# Altium project ESP32遥控.PrjPCB
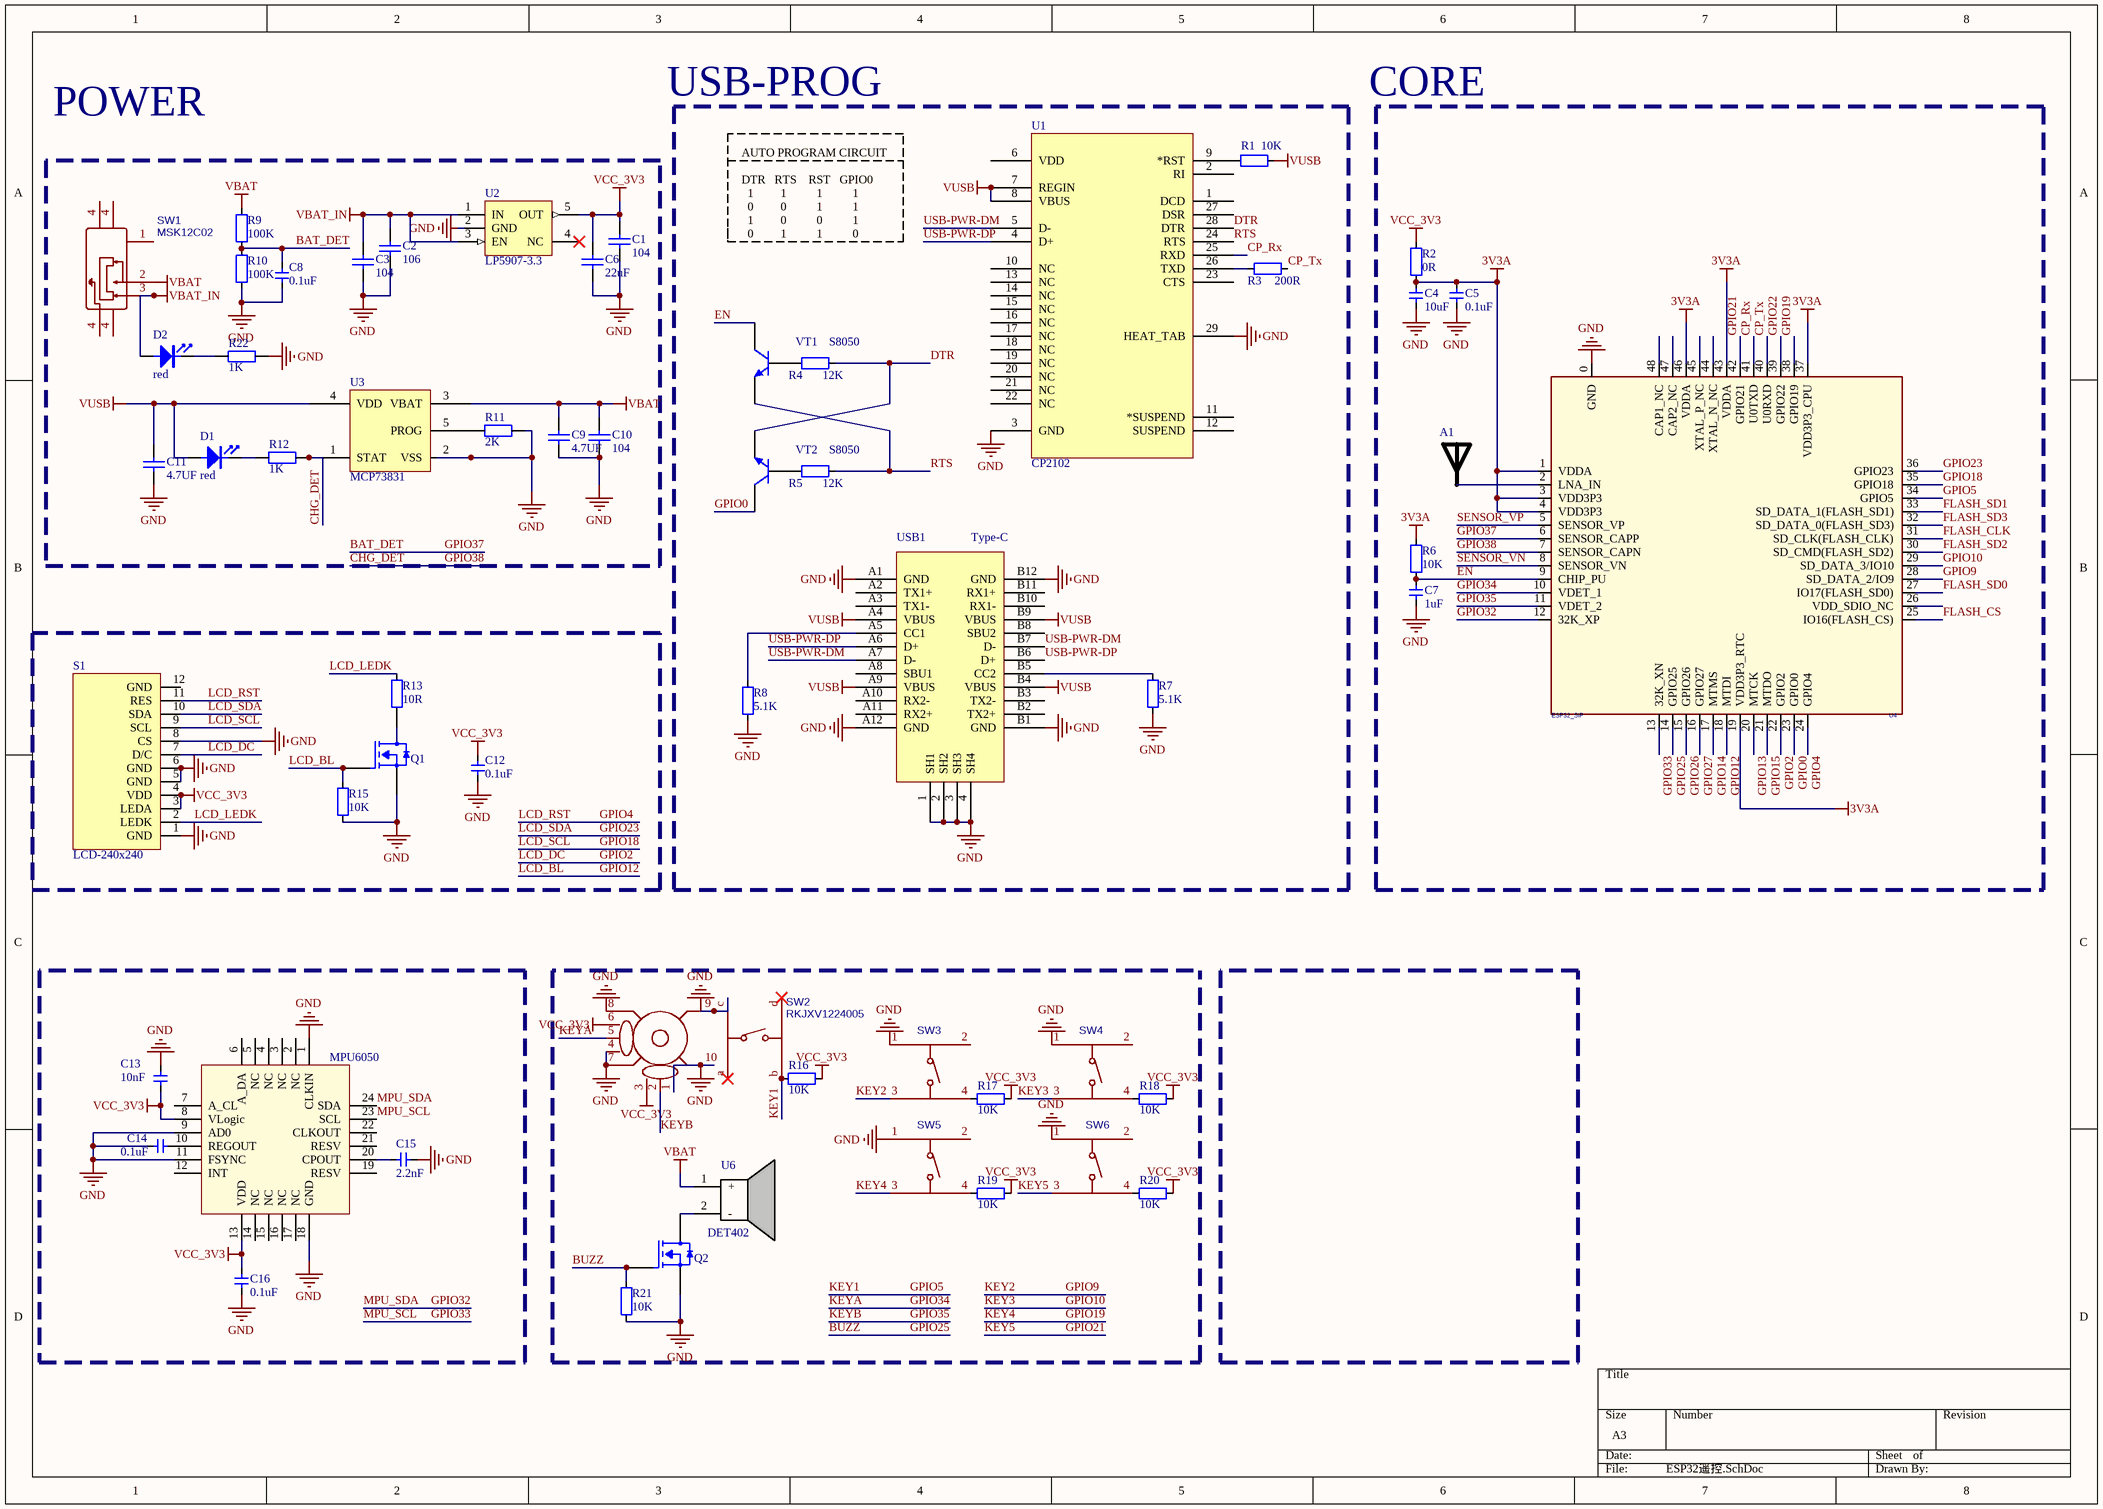
[diagram p0: ESP32遥控.SchDoc]
1 sheet, 58 parts. Net scope: global (net labels, ports and power ports of the same name join across sheets).
Board file: ESP32遥控.PcbDoc

## Sheet ESP32遥控.SchDoc
size A3

### Parts
A1  RAINSUN  [ANT-Rainsun-AN5120]  (value not drawn)
C1  104  [CAP_0402]
C2  106  [电容_C0603]
C3  104  [CAP_0402]
C4  10uF  [CAP_0402]
C5  0.1uF  [CAP_0402]
C6  22uF  [电容_C1206]
C7  1uF  [CAP_0402]
C8  0.1uF  [CAP_0402]
C9  4.7UF  [电容_C0805]
C10  104  [CAP_0402]
C11  4.7UF  [电容_C0805]
C12  0.1uF  [CAP_0402]
C13  10nF  [CAP_0402]
C14  0.1uF  [CAP_0402]
C15  2.2nF  [CAP_0402]
C16  0.1uF  [CAP_0402]
D1  red  [LED_0603]
D2  red  [LED_0603]
Q1  AO3400A  [SOT23-3]  (value not drawn)
Q2  AO3400A  [SOT23-3]  (value not drawn)
R1  10K  [RES_0402]
R2  0R  [RES_0402]
R3  200R  [RES_0402]
R4  12K  [RES_0402]
R5  12K  [RES_0402]
R6  10K  [RES_0402]
R7  5.1K  [RES_0402]
R8  5.1K  [RES_0402]
R9  100K  [RES_0402]
R10  100K  [RES_0402]
R11  2K  [RES_0402]
R12  1K  [RES_0402]
R13  10R  [RES_0402]
R15  10K  [RES_0402]
R16  10K  [RES_0402]
R17  10K  [RES_0402]
R18  10K  [RES_0402]
R19  10K  [RES_0402]
R20  10K  [RES_0402]
R21  10K  [RES_0402]
R22  1K  [RES_0402]
S1  LCD-240x240  [LCD-240x240-FlUSH-154]
SW1  MSK12C02  [SW-TH_MSK12C02]
SW2  RKJXV1224005  [SW-TH_RKJXV1224005]
SW3  (no value)  [KEY-SMD_4P-L6.0-W6.0-P4.50-LS8.6]
SW4  (no value)  [KEY-SMD_4P-L6.0-W6.0-P4.50-LS8.6]
SW5  (no value)  [KEY-SMD_4P-L6.0-W6.0-P4.50-LS8.6]
SW6  (no value)  [KEY-SMD_4P-L6.0-W6.0-P4.50-LS8.6]
U1  CP2102  [QFN-28]
U2  LP5907-3.3  [SOT23-5]
U3  MCP73831  [SOT23-5]
U4  ESP32_SIP  [QFN-48_7X7]
U5  MPU6050  [QFN-24]
U6  DET402  [DET402]
USB1  Type-C  [Type-C-TOP]
VT1  S8050  [SMT_TRIODE_NPN]
VT2  S8050  [SMT_TRIODE_NPN]

### Nets
3V3A: C4.2 C5.2 R2.2 R6.1 U4.1(VDDA) U4.3(VDD3P3) U4.4(VDD3P3) U4.19(VDD3P3_RTC) U4.37(VDD3P3_CPU) U4.43(VDDA) U4.46(VDDA)
GND: C1.1 C2.1 C3.1 C4.1 C5.1 C6.1 C7.2 C8.1 C9.1 C10.2 C11.1 C12.1 C13.2 C14.2 C15.1 C16.1 Q1.2(S) Q2.2(S) R7.2 R8.2 R10.1 R11.1 R15.1 R21.1 R22.1 S1.1(GND) S1.5(GND) S1.6(GND) S1.8(CS) SW2.1(B) SW2.4(A) SW2.7(GND) SW2.8(GND) SW2.9(GND) SW2.10(GND) SW2.c SW3.1 SW4.1 SW5.1 SW6.1 U1.3(GND) U1.29(HEAT_TAB) U2.2(GND) U3.2(VSS) U4.0(GND) U5.1(CLKIN) U5.9(AD0) U5.11(FSYNC) U5.18(GND) USB1.1(SH1) USB1.2(SH2) USB1.3(SH3) USB1.4(SH4) USB1.A1(GND) USB1.A12(GND) USB1.B1(GND) USB1.B12(GND)
VBAT: C9.2 C10.1 R9.2 SW1.2 U3.3(VBAT) U6.1(+)
VBAT_IN: C2.2 C3.2 D2.A SW1.3 U2.1(IN) U2.3(EN)
VCC_3V3: C1.2 C6.2 C12.2 C13.1 C16.2 R2.1 R16.2 R17.1 R18.1 R19.1 R20.1 S1.3(LEDA) S1.4(VDD) SW2.3(A) SW2.6(B) U2.5(OUT) U5.8(VLogic) U5.13(VDD)
VUSB: C11.2 D1.A R1.1 U1.7(REGIN) U1.8(VBUS) U3.4(VDD) USB1.A4(VBUS) USB1.A9(VBUS) USB1.B4(VBUS) USB1.B9(VBUS)
BAT_DET: C8.2 R9.1 R10.2 U4.6(SENSOR_CAPP)  [also labelled GPIO37]
BUZZ: Q2.1(G) R21.2 U4.14(GPIO25)  [also labelled GPIO25]
CHG_DET: R12.1 U3.1(STAT) U4.7(SENSOR_CAPN)  [also labelled GPIO38]
CP_Rx: U1.25(RXD) U4.41(U0TXD)
CP_Tx: R3.1 U4.40(U0RXD)
DTR: R4.1 U1.28(DTR) VT2.2(E)
EN: C7.1 R6.2 U4.9(CHIP_PU) VT1.3(C)
FLASH_CLK: U4.31(SD_CLK(FLASH_CLK))
FLASH_CS: U4.25(IO16(FLASH_CS))
FLASH_SD0: U4.27(IO17(FLASH_SD0))
FLASH_SD1: U4.33(SD_DATA_1(FLASH_SD1))
FLASH_SD2: U4.30(SD_CMD(FLASH_SD2))
FLASH_SD3: U4.32(SD_DATA_0(FLASH_SD3))
GPIO0: U4.23(GPIO0) VT2.3(C)
GPIO2: S1.7(D/C) U4.22(GPIO2)  [also labelled LCD_DC]
GPIO4: S1.11(RES) U4.24(GPIO4)  [also labelled LCD_RST]
GPIO5: R16.1 SW2.b U4.34(GPIO5)  [also labelled KEY1]
GPIO9: SW3.3 U4.28(SD_DATA_2/IO9)  [also labelled KEY2]
GPIO10: SW4.3 U4.29(SD_DATA_3/IO10)  [also labelled KEY3]
GPIO12: Q1.1(G) R15.2 U4.18(MTDI)  [also labelled LCD_BL]
GPIO13: U4.20(MTCK)
GPIO14: U4.17(MTMS)
GPIO15: U4.21(MTDO)
GPIO18: S1.9(SCL) U4.35(GPIO18)  [also labelled LCD_SCL]
GPIO19: SW5.3 U4.38(GPIO19)  [also labelled KEY4]
GPIO21: SW6.3 U4.42(GPIO21)  [also labelled KEY5]
GPIO22: U4.39(GPIO22)
GPIO23: S1.10(SDA) U4.36(GPIO23)  [also labelled LCD_SDA]
GPIO26: U4.15(GPIO26)
GPIO27: U4.16(GPIO27)
GPIO32: U4.12(32K_XP) U5.24(SDA)  [also labelled MPU_SDA]
GPIO33: U4.13(32K_XN) U5.23(SCL)  [also labelled MPU_SCL]
GPIO34: SW2.5(DTA) U4.10(VDET_1)  [also labelled KEYA]
GPIO35: SW2.2(DTA) U4.11(VDET_2)  [also labelled KEYB]
LCD_LEDK: R13.2 S1.2(LEDK)
RTS: R5.1 U1.24(RTS) VT1.2(E)
SENSOR_VN: U4.8(SENSOR_VN)
SENSOR_VP: U4.5(SENSOR_VP)
USB-PWR-DM: U1.5(D-) USB1.A7(D-) USB1.B7(D-)
USB-PWR-DP: U1.4(D+) USB1.A6(D+) USB1.B6(D+)
NetA1_1: A1.1 U4.2(LNA_IN)
NetC14_1: C14.1 U5.10(REGOUT)
NetC15_2: C15.2 U5.20(CPOUT)
NetD1_K: D1.K R12.2
NetD2_K: D2.K R22.2
NetQ1_3: Q1.3(D) R13.1
NetQ2_3: Q2.3(D) U6.2(-)
NetR1_2: R1.2 U1.9(*RST)
NetR3_2: R3.2 U1.26(TXD)
NetR4_2: R4.2 VT1.1(B)
NetR5_2: R5.2 VT2.1(B)
NetR7_1: R7.1 USB1.B5(CC2)
NetR8_1: R8.1 USB1.A5(CC1)
NetR11_2: R11.2 U3.5(PROG)
NetR17_2: R17.2 SW3.4
NetR18_2: R18.2 SW4.4
NetR19_2: R19.2 SW5.4
NetR20_2: R20.2 SW6.4

Not connected (* = marked no-connect by the designer): S1 12(GND); SW1 1 4; SW2 a* d*; SW3 2; SW4 2; SW5 2; SW6 2; U1 1(DCD) 2(RI) 6(VDD) 10(NC) 11(*SUSPEND) 12(SUSPEND) 13(NC) 14(NC) 15(NC) 16(NC) 17(NC) 18(NC) 19(NC) 20(NC) 21(NC) 22(NC) 23(CTS) 27(DSR); U2 4(NC)*; U4 26(VDD_SDIO_NC) 44(XTAL_N_NC) 45(XTAL_P_NC) 47(CAP2_NC) 48(CAP1_NC); U5 2(NC) 3(NC) 4(NC) 5(NC) 6(A_DA) 7(A_CL) 12(INT) 14(NC) 15(NC) 16(NC) 17(NC) 19(RESV) 21(RESV) 22(CLKOUT); USB1 A2(TX1+) A3(TX1-) A8(SBU1) A10(RX2-) A11(RX2+) B2(TX2+) B3(TX2-) B8(SBU2) B10(RX1-) B11(RX1+)

### Notes on the sheet
- USB-PROG
- CORE
- POWER
- AUTO PROGRAM CIRCUIT
  DTR   RTS    RST   GPIO0
  1         1          1          1
  0         0          1          1
  1         0          0          1
  0         1          1          0

### Library data of the parts
A1 = ANT-Rainsun-AP5120
C1-C3 C6 C9-C11 = cap: U: 50V; 参数: Cap,0805,X7R,104K,50V,125C,±10%
  C1 C3 C10: C: 104
  C2: C: 106
  C6: C: 22uF
  C9 C11: C: 4.7UF
C4 C5 C7 C8 C12-C16 = 电容-0402: Capacitor; Value: 0.1u
D1 D2 = LED: 参数: LED,0603,Red
Q1 Q2 = AO3400A: N-MOS
R1-R10 R13 R15-R21 = 电阻-0402: Resistor; Value: 22R
R11 R12 R22 = Res: P: 1/8W; 参数: Res,0805,0R,±1%,1/8W,100ppm,155C
  R11: R: 2K
  R12 R22: R: 1K
S1 = LCD-240x240: 显示屏
SW1 = MSK12C02: BOM_Manufacturer: SHOU HAN; Contributor: LCSC; Package Display: Yes; BOM_Supplier: LCSC; BOM_Supplier Part: C431540; BOM_Manufacturer Part: MSK12C02; BOM_JLCPCB Part Class: Extended Part; spicePre: S; spiceSymbolName: MSK12C02
SW2 = RKJXV1224005: BOM_Manufacturer: ALPS Electric; Contributor: LCSC; BOM_Supplier: LCSC; BOM_Supplier Part: C146170; BOM_Manufacturer Part: RKJXV1224005; BOM_JLCPCB Part Class: Extended Part; spicePre: S; spiceSymbolName: RKJXV1224005
SW3-SW6 = TS-1095S-A16B2-C2D1: BOM_Manufacturer: Yuandi; Contributor: LCSC; BOM_Supplier: LCSC; BOM_Supplier Part: C782843; BOM_Manufacturer Part: TS-1095S-A16B2-C2D1; BOM_JLCPCB Part Class: Extended Part; spicePre: S; spiceSymbolName: TS-1095S-A16B2-C2D1
U1 = CP2102: USB转TTL; PART DESC: SINGLE-CHIP USB TO UART BRIDGE, QFN28, RoHS.; MFG #1: SILICON LABS; PART NUMBER: CP2102; Value: Value; RefDes: RefDes; Type: DEV
U2 = LP5907: LDO
U3 = MCP73831: 线性充电管理控制器
U4 = ESP32-PICO
U5 = MPU6050: 六轴传感器
USB1 = USB-Type-C-TOP
VT1 VT2 = SMT_TRIODE_NPN: Surface mount NPN transistor, package SOT-23